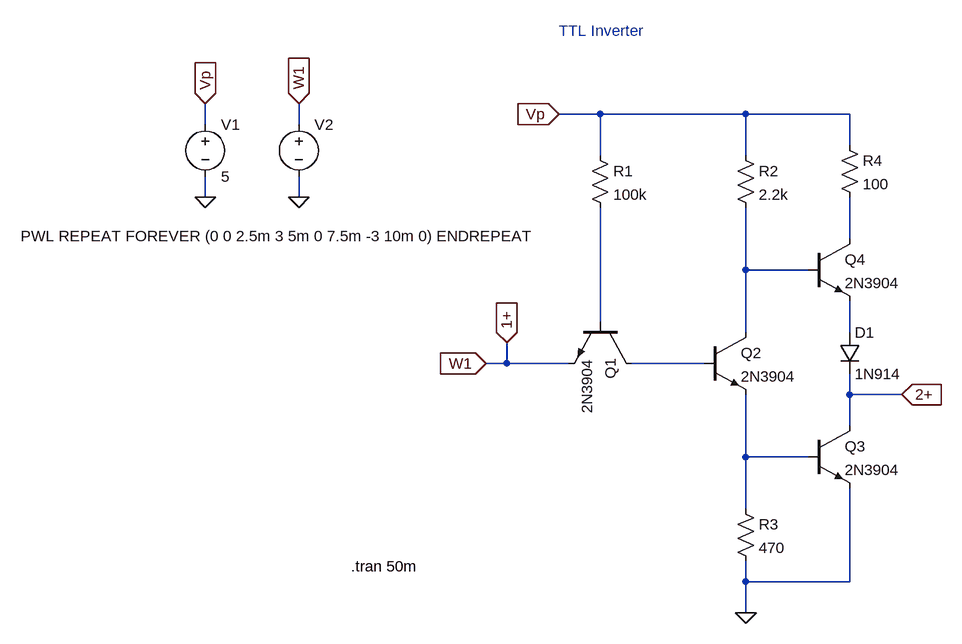
[diagram p0: schematic ttl_inv_ltspice.asc]
ttl_inv_ltspice.asc, the LTspice schematic file:
Version 4
SHEET 1 880 680
WIRE 128 -192 64 -192
WIRE 352 -192 128 -192
WIRE 512 -192 352 -192
WIRE -480 -176 -480 -208
WIRE -336 -176 -336 -208
WIRE 512 -144 512 -192
WIRE 128 -128 128 -192
WIRE 352 -128 352 -192
WIRE -480 -64 -480 -96
WIRE -336 -64 -336 -96
WIRE 512 0 512 -64
WIRE 352 48 352 -48
WIRE 448 48 352 48
WIRE 128 128 128 -48
WIRE 352 144 352 48
WIRE 512 144 512 96
WIRE -16 192 -16 160
WIRE -16 192 -48 192
WIRE 80 192 -16 192
WIRE 288 192 176 192
WIRE 512 240 512 208
WIRE 592 240 512 240
WIRE 512 288 512 240
WIRE 352 336 352 240
WIRE 448 336 352 336
WIRE 352 416 352 336
WIRE 352 528 352 496
WIRE 512 528 512 384
WIRE 512 528 352 528
WIRE 352 576 352 528
FLAG 352 576 0
FLAG 64 -192 Vp
IOPIN 64 -192 In
FLAG -48 192 W1
IOPIN -48 192 In
FLAG 592 240 2+
IOPIN 592 240 In
FLAG -16 160 1+
IOPIN -16 160 In
FLAG -480 -64 0
FLAG -336 -64 0
FLAG -480 -208 Vp
IOPIN -480 -208 In
FLAG -336 -208 W1
IOPIN -336 -208 In
SYMBOL npn 176 128 R90
SYMATTR InstName Q1
SYMATTR Value 2N3904
SYMBOL npn 288 144 R0
SYMATTR InstName Q2
SYMATTR Value 2N3904
SYMBOL npn 448 288 R0
SYMATTR InstName Q3
SYMATTR Value 2N3904
SYMBOL npn 448 0 R0
SYMATTR InstName Q4
SYMATTR Value 2N3904
SYMBOL res 112 -144 R0
SYMATTR InstName R1
SYMATTR Value 100k
SYMBOL res 336 -144 R0
SYMATTR InstName R2
SYMATTR Value 2.2k
SYMBOL res 336 400 R0
SYMATTR InstName R3
SYMATTR Value 470
SYMBOL res 496 -160 R0
SYMATTR InstName R4
SYMATTR Value 100
SYMBOL diode 496 144 R0
SYMATTR InstName D1
SYMATTR Value 1N914
SYMBOL voltage -480 -192 R0
WINDOW 123 0 0 Left 0
WINDOW 39 0 0 Left 0
SYMATTR InstName V1
SYMATTR Value 5
SYMBOL voltage -336 -192 R0
WINDOW 3 -428 188 Left 2
WINDOW 123 0 0 Left 0
WINDOW 39 0 0 Left 0
SYMATTR InstName V2
SYMATTR Value PWL REPEAT FOREVER (0 0 2.5m 3 5m 0 7.5m -3 10m 0) ENDREPEAT
TEXT -256 504 Left 2 !.tran 50m
TEXT 64 -320 Left 2 ;TTL Inverter

The netlist it stands for:
* ttl_inv_ltspice.asc
Q1 N005 N003 1+ 0 2N3904
Q2 N002 N005 N006 0 2N3904
Q3 2+ N006 0 0 2N3904
Q4 N001 N002 N004 0 2N3904
R1 Vp N003 100k
R2 Vp N002 2.2k
R3 N006 0 470
R4 Vp N001 100
D1 N004 2+ 1N914
V1 Vp 0 5
V2 1+ 0 PWL REPEAT FOREVER (0 0 2.5m 3 5m 0 7.5m -3 10m 0) ENDREPEAT
.model D D
.lib standard.dio
.model NPN NPN
.model PNP PNP
.lib standard.bjt
.tran 50m
* TTL Inverter
.backanno
.end